# Altium schematic sheet LPCB224 - PI.SchDoc
size A3; Address1: Factory 10; Address2: 9-13 Dingley Avenue, Dandeong, VICTORIA 3175, AUSTRALIA; DocumentNumber: 4; Revision: 1; SheetNumber: 4; SheetTotal: 7; Lockie__PCB_SUB_ASSEMBLY: PI Interface; Lockie__PCB_ASSEMBLY: Core Node; Lockie__LDL: LPCB224; Lockie__PCB_DESCRIPTION: Core Node
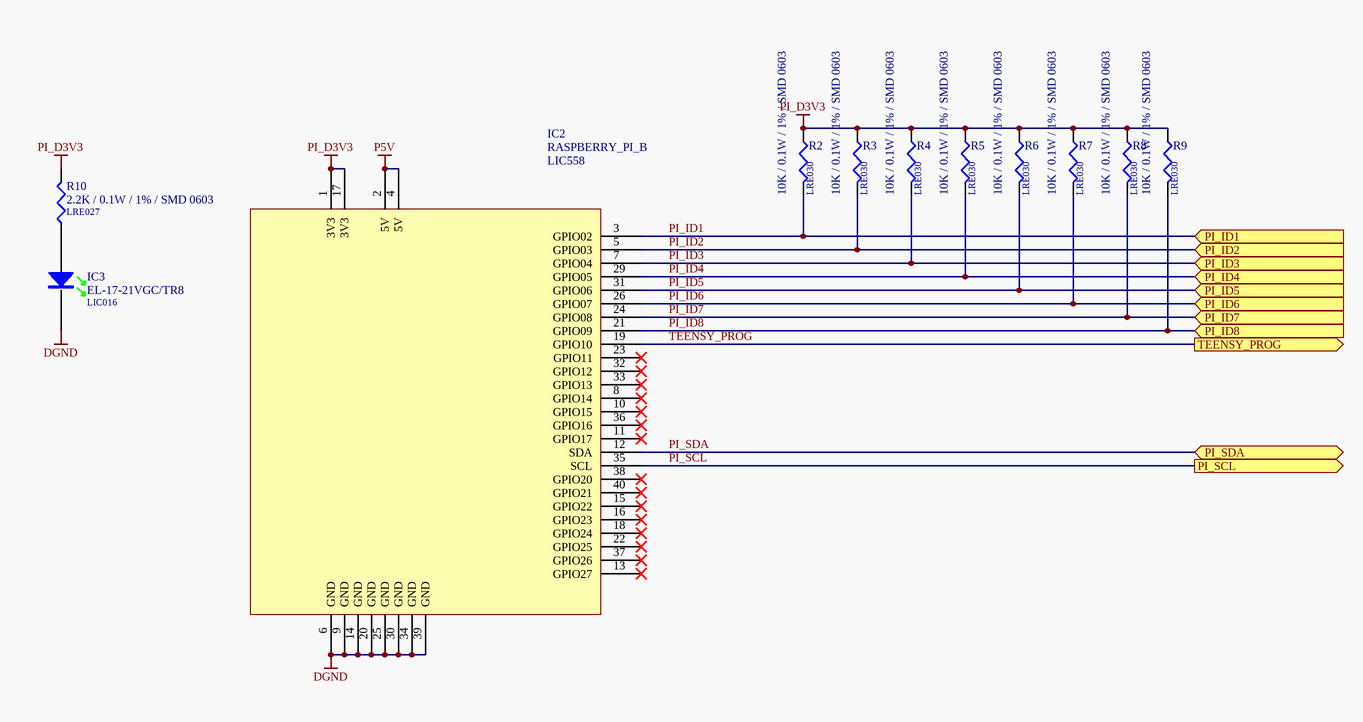
[diagram p0: LPCB224 - PI.SchDoc]

## Parts
IC2  RASPBERRY_PI_B  LDL_NUMBER: LIC558  [RASPBERRY_PI_B]
IC3  EL-17-21VGC/TR8  LDL_NUMBER: LIC016  [CR2012-0805-LED]
R2  10K / 0.1W / 1% / SMD 0603  LDL_NUMBER: LRE030  [LFP020__CR1608-0603-IPC7351_B]
R3  10K / 0.1W / 1% / SMD 0603  LDL_NUMBER: LRE030  [LFP020__CR1608-0603-IPC7351_B]
R4  10K / 0.1W / 1% / SMD 0603  LDL_NUMBER: LRE030  [LFP020__CR1608-0603-IPC7351_B]
R5  10K / 0.1W / 1% / SMD 0603  LDL_NUMBER: LRE030  [LFP020__CR1608-0603-IPC7351_B]
R6  10K / 0.1W / 1% / SMD 0603  LDL_NUMBER: LRE030  [LFP020__CR1608-0603-IPC7351_B]
R7  10K / 0.1W / 1% / SMD 0603  LDL_NUMBER: LRE030  [LFP020__CR1608-0603-IPC7351_B]
R8  10K / 0.1W / 1% / SMD 0603  LDL_NUMBER: LRE030  [LFP020__CR1608-0603-IPC7351_B]
R9  10K / 0.1W / 1% / SMD 0603  LDL_NUMBER: LRE030  [LFP020__CR1608-0603-IPC7351_B]
R10  2.2K / 0.1W / 1% / SMD 0603  LDL_NUMBER: LRE027  [LFP020__CR1608-0603-IPC7351_B]

## Ports
PI_ID1 (in), PI_ID2 (in), PI_ID3 (in), PI_ID4 (in), PI_ID5 (in), PI_ID6 (in), PI_ID7 (in), PI_ID8 (in), PI_SCL (out), PI_SDA (bidir), TEENSY_PROG (out)

## Nets
DGND: IC2.6(GND) IC2.9(GND) IC2.14(GND) IC2.20(GND) IC2.25(GND) IC2.30(GND) IC2.34(GND) IC2.39(GND) IC3.K
P5V: IC2.2(5V) IC2.4(5V)
PI_D3V3: IC2.1(3V3) IC2.17(3V3) R2.1 R3.1 R4.1 R5.1 R6.1 R7.1 R8.1 R9.1 R10.2
PI_ID1: IC2.3(GPIO02) R2.2 ; port PI_ID1
PI_ID2: IC2.5(GPIO03) R3.2 ; port PI_ID2
PI_ID3: IC2.7(GPIO04) R4.2 ; port PI_ID3
PI_ID4: IC2.29(GPIO05) R5.2 ; port PI_ID4
PI_ID5: IC2.31(GPIO06) R6.2 ; port PI_ID5
PI_ID6: IC2.26(GPIO07) R7.2 ; port PI_ID6
PI_ID7: IC2.24(GPIO08) R8.2 ; port PI_ID7
PI_ID8: IC2.21(GPIO09) R9.2 ; port PI_ID8
PI_SCL: IC2.35(SCL) ; port PI_SCL
PI_SDA: IC2.12(SDA) ; port PI_SDA
TEENSY_PROG: IC2.19(GPIO10) ; port TEENSY_PROG
NetIC3_A: IC3.A R10.1

Not connected (* = marked no-connect by the designer): IC2 8(GPIO14)* 10(GPIO15)* 11(GPIO17)* 13(GPIO27)* 15(GPIO22)* 16(GPIO23)* 18(GPIO24)* 22(GPIO25)* 23(GPIO11)* 32(GPIO12)* 33(GPIO13)* 36(GPIO16)* 37(GPIO26)* 38(GPIO20)* 40(GPIO21)*

## Notes on the sheet
- PCB COMPONENT DESCRIPTION
- LDL NUMBER
- Assembly Details
- Size
- Drawing File Name
- Revision
- http://rloop.org
- Scale
- A3
- Sheet Details
- N.T.S
- Sheet:
- Of:

## Library data of the parts
IC2 = RASPBERRY_PI_B: Raspberry Pi Model B
IC3 = EL-17-21VGC/TR8: LED, SMD, 0805 Green [LIC016]; FMEDA__OPERATING__TEMP_MAX: 50; FMEDA__OPERATING__TEMP_MIN: -20; FMEDA__OPERATING__TEMP_TYP: 27; FMEDA__CHANNEL: COM; FMEDA__FUNCTION_IN_SYSTEM: *
R2-R9 = 10K / 0.1W / 1% / SMD 0603: Resistor, Ceramic Chip, 10K, 0.1W, 1%, SMD 0603 [LRE030]; FMEDA__OPERATING__POWER_MAX: 0; FMEDA__OPERATING__TEMP_MAX: 50; FMEDA__OPERATING__TEMP_MIN: -20; FMEDA__OPERATING__TEMP_TYP: 27; FMEDA__CHANNEL: COM; Value: 10K; FMEDA__OPERATING__POWER_MIN: 0; FMEDA__OPERATING__VOLTAGE_MAX: 0; FMEDA__OPERATING__VOLTAGE_MIN: 0; FMEDA__OPERATING__VOLTAGE_TYP: 0; FMEDA__FUNCTION_IN_SYSTEM: *
R10 = 2.2K / 0.1W / 1% / SMD 0603: Resistor, Ceramic Chip, 2.2K, 0.1W, 1%, SMD 0603 [LRE027]; FMEDA__OPERATING__VOLTAGE_MIN: 0; FMEDA__OPERATING__TEMP_MIN: -20; FMEDA__OPERATING__TEMP_TYP: 27; FMEDA__OPERATING__TEMP_MAX: 50; FMEDA__CHANNEL: COM; VALUE: 2.2K; FMEDA__OPERATING__VOLTAGE_MAX: 0; FMEDA__OPERATING__POWER_MIN: 0; FMEDA__OPERATING__POWER_MAX: 0; FMEDA__FUNCTION_IN_SYSTEM: *; FMEDA__OPERATING__VOLTAGE_TYP: 0